# Altium schematic sheet Power.SchDoc
size B
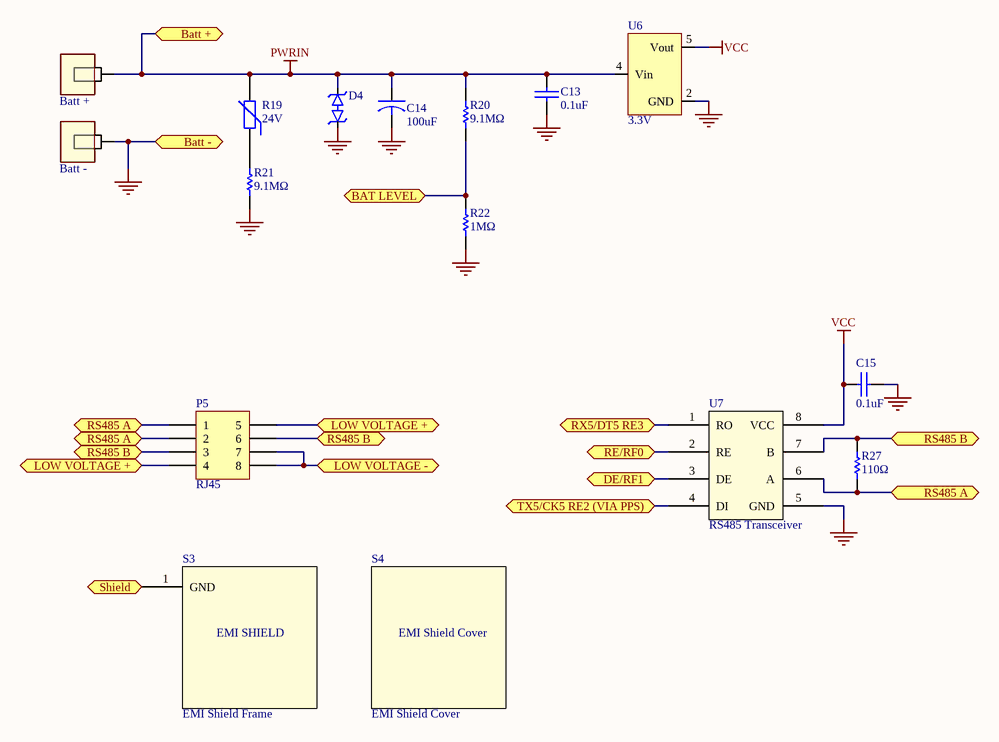
[diagram p0: Power.SchDoc]

## Parts
B+1  Batt +  [45 mil hole]
B-1  Batt -  [45 mil hole]
C13  0.1uF  [0603 Small]
C14  100uF  [ALEL_D8]
C15  0.1uF  [0603 Small]
D4  SMAJ20  [sma+]  (value not drawn)
P5  RJ45  [RJ45 Modular Connector 8p8c]
R19  24V  [0603 Small]
R20  9.1MΩ  [0603 Resistor]
R21  9.1MΩ  [0603 Resistor]
R22  1MΩ  [0603 Resistor]
R27  110Ω  [0603 Resistor]
S3  EMI Shield Frame  [SMS-1020]
S4  EMI Shield Cover
U6  3.3V  [SC70_5]
U7  RS485 Transceiver  [SOIC-8]

## Ports
BAT LEVEL (bidir), Batt +, Batt -, DE/RF1, LOW VOLTAGE +, LOW VOLTAGE -, RE/RF0, RS485 A, RS485 B, RX5/DT5 RE3, Shield, TX5/CK5 RE2 (VIA PPS)

## Nets
GND: B-1.1 C13.2 C14.2 C15.1 D4.1 R21.2 R22.2 U6.2(GND) U7.5(GND) ; port Batt -
PWRIN: B+1.1 C13.1 C14.1 D4.2 R19.2 R20.1 U6.4(Vin) ; port Batt +
VCC: C15.2 U6.5(Vout) U7.8(VCC)
BAT LEVEL: R20.2 R22.1 ; port BAT LEVEL
DE/RF1: U7.3(DE) ; port DE/RF1
LOW VOLTAGE +: P5.4 P5.5 ; port LOW VOLTAGE +
LOW VOLTAGE -: P5.7 P5.8 ; port LOW VOLTAGE -
RE/RF0: U7.2(RE) ; port RE/RF0
RS485 A: P5.1 P5.2 R27.2 U7.6(A) ; port RS485 A
RS485 B: P5.3 P5.6 R27.1 U7.7(B) ; port RS485 B
RX5/DT5 RE3: U7.1(RO) ; port RX5/DT5 RE3
Shield: S3.1(GND) ; port Shield
TX5/CK5 RE2 (VIA PPS): U7.4(DI) ; port TX5/CK5 RE2 (VIA PPS)
NetR19_1: R19.1 R21.1

## Notes on the sheet
- Title
- Size:
- Date:
- B
- Number:
- Time:
- Revision:
- Sheet
- of
- File:

## Library data of the parts
B+1 = Motor+Term: 7055 Series, Two Inches in length
B-1 = Motor-Term: 7055 Series, Two Inches in length; Manufacturer: Alpha Wire; Manufacturer#: 7055 BK005; Cost: 0.125
C13 C15 = CAP: CAP CER 0.1UF 50V 10% X7R 0603; Manufacturer#: GRM188R71H104KA93J; Manufacturer: Murata Electronics; Cost: 0.022
C14 = CAPACITOR: CAP ALUM 100UF 35V 20% SMD; Manufacturer: PANASONIC - ECG; Manufacturer#: EEE-1VA101XP; Cost: 0.1202
D4 = TVS Diode: TVS 20V 400 Watts; Manufacturer: MCC; Manufacturer#: SMAJ20CA-TP; Cost: 0.104
P5 = Header 4X2A: Header, 4-Pin, Dual row; Manufacturer: Stewart Connector; Manufacturer#: SS-60000-010; Cost: 1.2315
R19 = Res Varistor: Varistor (Voltage-Sensitive Resistor); Manufacturer: Bourns Inc.; Manufacturer#: CG0603MLC-24LE; Cost: .11124
R20 R21 = Res1: RES SMD 9.1M OHM 5% 1/10W 0603; Manufacturer: Yageo; Manufacturer#: RC0603JR-079M1L; Cost: .00187
R22 = Res1: RES SMD 1M OHM 5% 1/10W 0603; Manufacturer: Yageo; Manufacturer#: RC0603JR-071ML; Cost: .00198
R27 = Res1: RES SMD 110 OHM 5% 1/10W 0603; Manufacturer: Yageo; Manufacturer#: RC0603JR-07110RL; Cost: 0.00207
S3 = BMI-S-101 EMI Shield: EMI SHIELD; Manufacturer: LEADER TECH; Manufacturer#: SMS-1020F; Cost: 0.59
S4 = EMI Shield Cover: SMS Cover; Manufacturer: LEADER TECH; Manufacturer#: SMS-1020C; Cost: 0.18
U6 = LMV1703T: LDO Voltage Regulators 50mA 3.3V HI LDO; Manufacturer: Texas Instruments; Manufacturer#: TPS71533DCKR; Vendor: Arrow; Cost: 0.3076
U7 = ST3485ECDR Transceiver Half RS422,RS485: Single Transmitter/Receiver RS-422/RS-485 8-Pin SO N T/R; Manufacturer: STMicroelectronics; Manufacturer#: ST3485ECDR; Cost: 0.67053